# EAGLE design encoder (EAGLE 6.6.0)
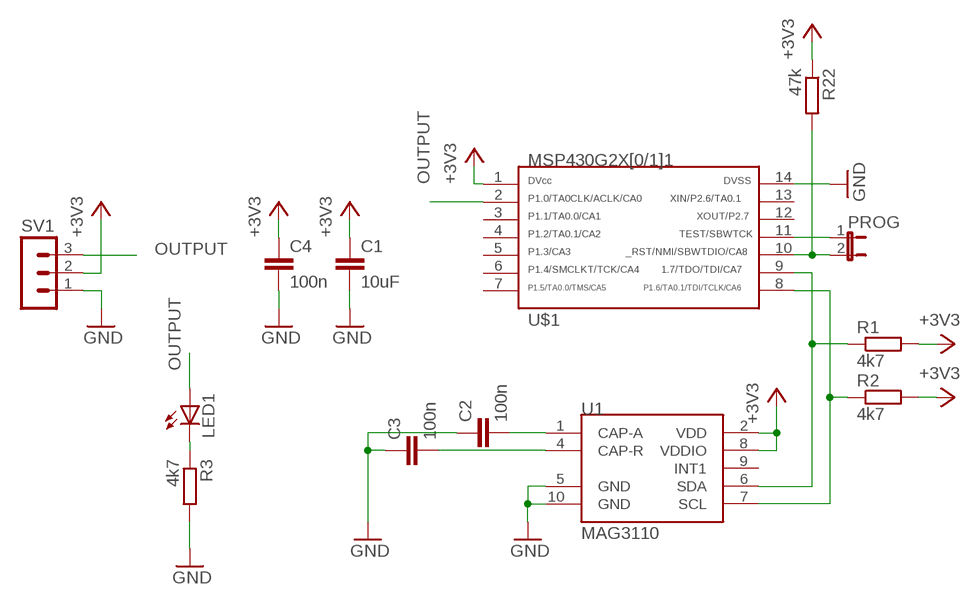
[diagram p0: schematic, sheet 1]

## Parts
C1  10uF  C-EUC0805  [C0805]
C2  100n  C-EUC0805  [C0805]
C3  100n  C-EUC0805  [C0805]
C4  100n  C-EUC0805  [C0805]
LED1  LEDSML1206  [SML1206]
PROG  JP1E  [JP1]
R1  4k7  R-EU_M0805  [M0805]
R2  4k7  R-EU_M0805  [M0805]
R3  4k7  R-EU_M0805  [M0805]
R22  47k  R-EU_M0805  [M0805]
SV1  MA03-1  [MA03-1]
U1  MAG3110  [DFN-10]
U$1  G2X[0/1]1---PW14  [PW14]

## Nets
+3V3: C1.1 C4.1 R1.2 R2.2 R22.1 SV1.2 U1.2(VDD) U1.8(VDDIO) U$1.1
GND: C1.2 C2.1 C3.1 C4.2 R3.2 SV1.1 U1.5(GND) U1.10(GND) U$1.14
N$1: PROG.1 U$1.11
N$2: PROG.2 R22.2 U$1.10
N$3: R1.1 U1.6(SDA) U$1.9
N$4: R2.1 U1.7(SCL) U$1.8
N$5: C3.2 U1.4(CAP-R)
N$6: C2.2 U1.1(CAP-A)
N$7: LED1.C R3.1
OUTPUT: LED1.A SV1.3 U$1.2
Unconnected: U1.9(INT1) U$1.3 U$1.4 U$1.5 U$1.6 U$1.7 U$1.12 U$1.13

## Library data of the parts
C1-C4 = resistor:C-EU: CAPACITOR, European symbol
LED1 = my_parts:LED: LED OSRAM: - CHIPLED LG R971, LG N971, LY N971, LG Q971, LY Q971, LO R971, LY R971 LH N974, LH R974 LS Q976, LO Q976, LY Q976 LO Q996 - Hyper CHIPLED LW Q18S LB Q993, LB Q99A, LB R99A - SideLED LS A670, LO A670, LY A670, LG A670, LP A670 LB A673, LV A673, LT A673, LW A673 LH A674 LY A675 LS A676, LA A676, LO A676, LY A676, LW A676 LS A679, LY A679, LG A679 - Hyper Micro SIDELED® LS Y876, LA Y876, LO Y876, LY Y876 LT Y87S - SmartLED LW L88C, LW L88S LB L89C, LB L89S, LG L890 LS L89K, LO L89K, LY L89K LS L896, LA L896, LO L896, LY L896 - TOPLED LS T670, LO T670, LY T670, LG T670, LP T670 LSG T670, LSP T670, LSY T670, LOP T670, LYG T670 LG T671, LOG T671, LSG T671 LB T673, LV T673, LT T673, LW T673 LH T674 LS T676, LA T676, LO T676, LY T676, LB T676, LH T676, LSB T676, LW T676 LB T67C, LV T67C, LT T67C, LS T67K, LO T67K, LY T67K, LW E67C LS E67B, LA E67B, LO E67B, LY E67B, LB E67C, LV E67C, LT E67C LW T67C LS T679, LY T679, LG T679 LS T770, LO T770, LY T770, LG T770, LP T770 LB T773, LV T773, LT T773, LW T773 LH T774 LS E675, LA E675, LY E675, LS T675 LS T776, LA T776, LO T776, LY T776, LB T776 LHGB T686 LT T68C, LB T68C - Hyper Mini TOPLED® LB M676 - Mini TOPLED Santana® LG M470 LS M47K, LO M47K, LY M47K Source: http://www.osram.convergy.de LUXEON: - LUMILED® LXK2-PW12-R00, LXK2-PW12-S00, LXK2-PW14-U00, LXK2-PW14-V00 LXK2-PM12-R00, LXK2-PM12-S00, LXK2-PM14-U00 LXK2-PE12-Q00, LXK2-PE12-R00, LXK2-PE12-S00, LXK2-PE14-T00, LXK2-PE14-U00 LXK2-PB12-K00, LXK2-PB12-L00, LXK2-PB12-M00, LXK2-PB14-N00, LXK2-PB14-P00, LXK2-PB14-Q00 LXK2-PR12-L00, LXK2-PR12-M00, LXK2-PR14-Q00, LXK2-PR14-R00 LXK2-PD12-Q00, LXK2-PD12-R00, LXK2-PD12-S00 LXK2-PH12-R00, LXK2-PH12-S00 LXK2-PL12-P00, LXK2-PL12-Q00, LXK2-PL12-R00 Source: www.luxeon.com KINGBRIGHT: KA-3528ASYC Source: www.kingbright.com
PROG = jumper:JP1E: JUMPER
R1-R3 R22 = resistor:R-EU_: RESISTOR, European symbol
SV1 = con-lstb:MA03-1: PIN HEADER; OC_FARNELL: unknown; OC_NEWARK: unknown
U1 = SparkFun-Sensors:MAG3110: 3-axis digital (I2C) magnetometer
U$1 = my_parts:G2X[0/1]1---PW14: MSP430G2X[0/1]1 MSP430G2001, MSP430G2101, MSP430G2201,MSP430G2111, G2211 TSSOP (PW) 14 Pin Package http://focus.ti.com/docs/prod/folders/print/msp430g2111.html

## Board
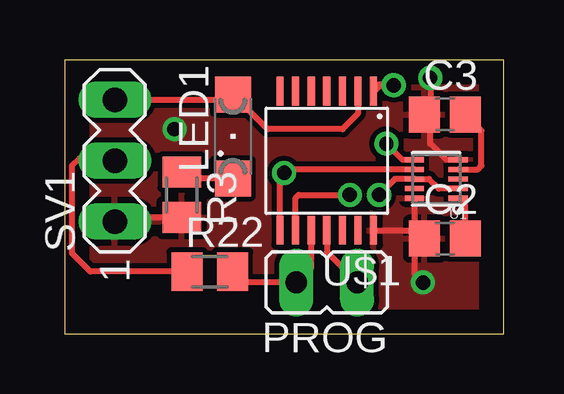
[diagram p1: board, top side]
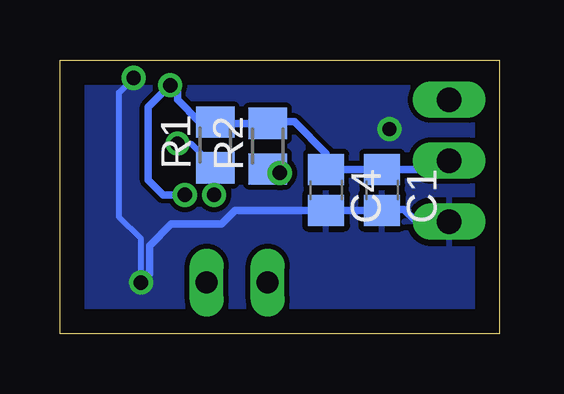
[diagram p2: board, bottom side, seen from below]

Size 18.31 x 11.42 mm. Coordinates in mm from the lower left corner, seen from the top.
Outline: 0,0 18.31,0 18.31,11.42 0,11.42 0,0
Copper layers (1*16): Top 0.035mm / dielectric 1.5mm / Bottom 0.035mm
Design rules "default": minimum track width 10mil, minimum drill 24mil, track to track 8mil, track to pad 8mil, pad to pad 8mil, via to via 8mil, smd to smd 8mil, copper to edge 40mil, drill to drill 8mil, minimum pad ring 10mil, minimum via ring 8mil, stop-mask expansion 4mil, vias tented up to drill 0mil, thermal gap 10mil

### Footprints (pad centres in the part's own frame; a part is rotated, then mirrored left to right if it is on the bottom)
C0805 = smd 1.3 x 1.5: 1 -0.85,0; 2 0.85,0
SML1206 = smd 1.5 x 1.5: A 1.75,0; C -1.75,0
JP1 = drill 0.914 long: 1 0,-1.27; 2 0,1.27
M0805 = smd 1.3 x 1.6: 1 -0.95,0; 2 0.95,0
MA03-1 = drill 1.016 long: 1 -2.54,0; 2 0,0; 3 2.54,0
DFN-10 = smd 0.8 x 0.22: 1 -0.91,0.8; 2 -0.91,0.4; 3 -0.91,0; 4 -0.91,-0.4; 5 -0.91,-0.8; 6 0.91,-0.8; 7 0.91,-0.4; 8 0.91,0; 9 0.91,0.4; 10 0.91,0.8
PW14 = smd 0.3 x 1.2: 1 -1.95,-2.9; 2 -1.3,-2.9; 3 -0.65,-2.9; 4 0,-2.9; 5 0.65,-2.9; 6 1.3,-2.9; 7 1.95,-2.9; 8 1.95,2.9; 9 1.3,2.9; 10 0.65,2.9; 11 0,2.9; 12 -0.65,2.9; 13 -1.3,2.9; 14 -1.95,2.9

### Placement (x,y rotation side)
C1  4.88,5.99 270 bottom
C2  15.85,3.96 0 top
C3  15.85,9.14 0 top
C4  7.21,5.99 270 bottom
LED1  7.01,8.23 90 top
PROG  10.92,2.13 90 top
R1  11.84,7.87 90 bottom
R2  9.65,7.82 90 bottom
R3  4.88,5.79 270 top
R22  6.05,2.59 0 top
SV1  2.08,7.21 90 top
U1  15.49,6.45 180 top
U$1  10.92,7.21 180 top

### Tracks (layer width: path | path; a pad name or v marks a point on that pad's centre or on a via)
+3V3  (via drill 0.6)
  Top 0.254: U1.2 15.59,6.05 15.19,6.45 U1.8 13.77,6.45 v13.11,5.79 | R22.1 1.07,2.59 0.3,3.35 0.3,7.01 0.61,7.32 1.98,7.32 SV1.2
  Top 0.305: v13.72,10.36 13.12,10.36 U$1.1
  Bottom 0.305: v13.11,5.79 14.02,5.79 14.63,6.4 14.63,9.45 v13.72,10.36 13.41,10.06 13.41,9.75 12.48,8.82 R1.2 11.79,8.77 R2.2 9.59,8.84 8.53,8.84 7.21,7.52 C4.1 C1.1 2.45,6.84 SV1.2
GND  (via drill 0.6)
  Top 0.254: 14.58,4.38 U1.10 14.58,2.48 v14.94,2.13 | 14.58,4.38 C2.1 | U$1.14 14.52,4.31 14.58,4.38 | U1.5 15.91,7.25 15.24,7.92 15.24,8.9 C3.1 15.24,9.38 v15.24,10.67 | R3.2 2.25,4.84 SV1.1
  Bottom 0.254: v14.94,2.13 14.94,3.96 15.85,4.88 15.85,10.06 v15.24,10.67
  Bottom 0.305: SV1.1 3.45,4.67 3.96,5.18 4.84,5.18 C1.2 C4.2 11.01,5.14 11.58,4.57 13.67,4.57 14.58,3.66 14.58,2.48 v14.94,2.13
  other vias: 4.57,8.53
  pour Top: -1.52,12.5 18.9,12.5 18.9,-1.52 -1.52,-1.52
  pour Bottom: -3.05,13.11 18.9,13.11 18.9,-2.13 -3.05,-2.13
N$1
  Top 0.254: U$1.11 10.92,3.4 PROG.1
N$2
  Top 0.254: U$1.10 10.27,2.75 PROG.2 7.45,2.13 R22.2
N$3  (via drill 0.6)
  Top 0.254: U$1.9 9.62,5.66 9.75,5.79 v11.89,5.79 | U1.6 14.08,7.25 v13.41,7.92
  Bottom 0.254: v11.89,5.79 11.89,6.87 R1.1 12.84,7.92 v13.41,7.92
N$4  (via drill 0.6)
  Top 0.254: U$1.8 8.97,6.53 v9.14,6.71 9.29,6.85 U1.7
  Bottom 0.254: v9.14,6.71 9.48,6.71 R2.1
N$5
  Top 0.254: U1.4 17.21,6.85 17.37,7.01 17.37,8.47 C3.2
N$6
  Top 0.254: C2.2 16.7,5.36 U1.1
N$7
  Top 0.254: LED1.C 5.14,6.48 R3.1
OUTPUT
  Top 0.254: SV1.3 6.78,9.75 LED1.A 8.46,8.53 11.58,8.53 12.22,9.17 U$1.2